# EAGLE board SBC_rev 3 (EAGLE 8.5.0)
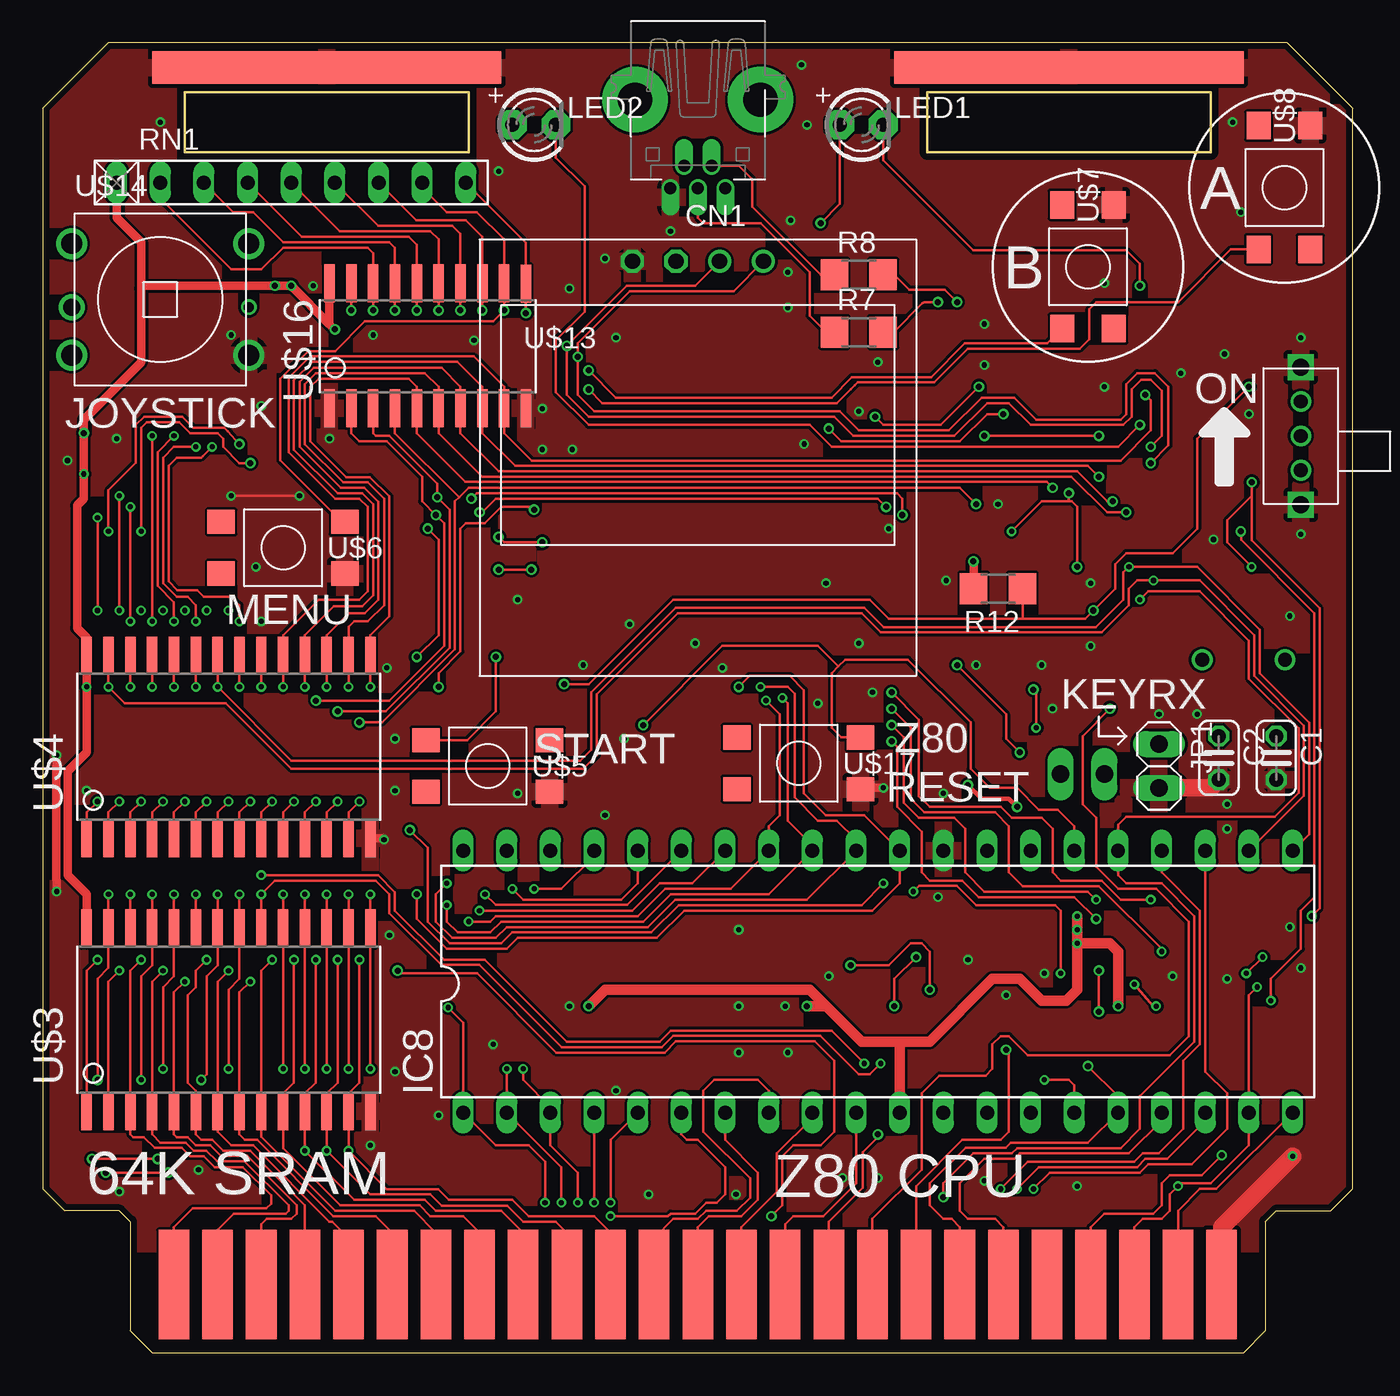
[diagram p2: board, top side]
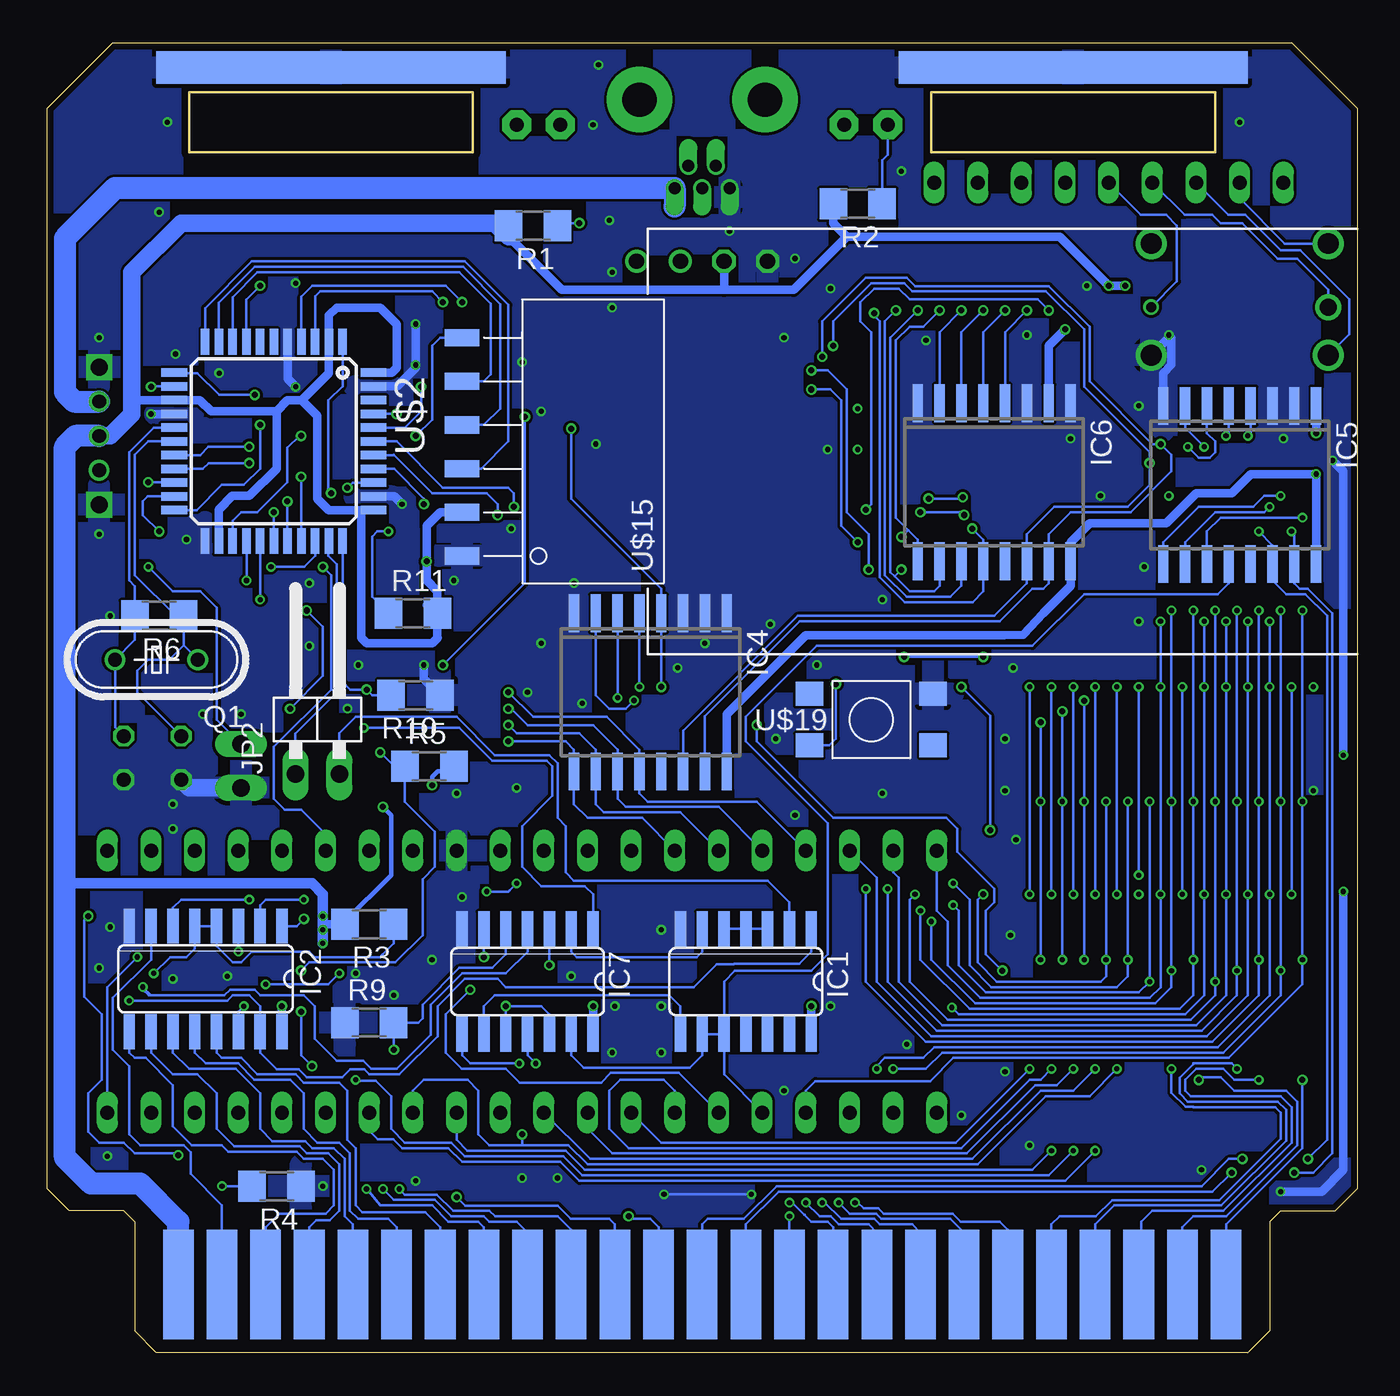
[diagram p3: board, bottom side, seen from below]

Size 76.2 x 76.2 mm. Coordinates in mm from the lower left corner, seen from the top.
Outline: 6.35,0 69.85,0 71.12,1.27 71.12,7.62 71.75,8.26 74.93,8.26 76.2,9.53 76.2,72.39 72.39,76.2 3.81,76.2 0,72.39 0,9.53 1.27,8.26 4.45,8.26 5.08,7.62 5.08,1.27 6.35,0
Outline: 8.26,69.85 24.77,69.85 24.77,73.34 8.26,73.34 8.26,69.85
Outline: 51.44,69.85 67.94,69.85 67.94,73.34 51.44,73.34 51.44,69.85
Copper layers (1*16): Top 0.035559375mm / dielectric 1.6mm / Bottom 0.035559375mm
Design rules "oshpark-2layer": minimum track width 6mil, minimum drill 10mil, track to track 6mil, track to pad 6mil, pad to pad 6mil, via to via 6mil, smd to smd 6mil, copper to edge 15mil, drill to drill 6mil, minimum pad ring 5mil, minimum via ring 5mil, stop-mask expansion 2.5mil, vias tented up to drill 0mil, thermal gap 10mil

## Footprints (pad centres in the part's own frame; a part is rotated, then mirrored left to right if it is on the bottom)
RESISTOR_C025-024X044 = drill 0.813 octagon: 1 -1.27,0; 2 1.27,0
USB-MINIB-THM-MOLEX = drill 0.7 offset: D+ 0,9.72; D- -0.8,8.42; GND 1.6,9.72; ID 0.8,8.42; VBUS -1.6,9.72 | drill 2 pad 3.81: GND1 -3.65,4.57; GND4 3.65,4.57
SO14 = smd 0.66 x 2.032: 1 -3.81,-3.073; 2 -2.54,-3.073; 3 -1.27,-3.073; 4 0,-3.073; 5 1.27,-3.073; 6 2.54,-3.073; 7 3.81,-3.073; 8 3.81,3.073; 9 2.54,3.073; 10 1.27,3.073; 11 0,3.073; 12 -1.27,3.073; 13 -2.54,3.073; 14 -3.81,3.073
SO16 = smd 0.66 x 2.032: 1 -4.445,-3.073; 2 -3.175,-3.073; 3 -1.905,-3.073; 4 -0.635,-3.073; 5 0.635,-3.073; 6 1.905,-3.073; 7 3.175,-3.073; 8 4.445,-3.073; 9 4.445,3.073; 10 3.175,3.073; 11 1.905,3.073; 12 0.635,3.073; 13 -0.635,3.073; 14 -1.905,3.073; 15 -3.175,3.073; 16 -4.445,3.073
SO16W = smd 0.6 x 2.2: 1 -4.445,-4.6; 2 -3.175,-4.6; 3 -1.905,-4.6; 4 -0.635,-4.6; 5 0.635,-4.6; 6 1.905,-4.6; 7 3.175,-4.6; 8 4.445,-4.6; 9 4.445,4.6; 10 3.175,4.6; 11 1.905,4.6; 12 0.635,4.6; 13 -0.635,4.6; 14 -1.905,4.6; 15 -3.175,4.6; 16 -4.445,4.6
DIL40 = drill 0.813 long: 1 -24.13,-7.62; 2 -21.59,-7.62; 3 -19.05,-7.62; 4 -16.51,-7.62; 5 -13.97,-7.62; 6 -11.43,-7.62; 7 -8.89,-7.62; 8 -6.35,-7.62; 9 -3.81,-7.62; 10 -1.27,-7.62; 11 1.27,-7.62; 12 3.81,-7.62; 13 6.35,-7.62; 14 8.89,-7.62; 15 11.43,-7.62; 16 13.97,-7.62; 17 16.51,-7.62; 18 19.05,-7.62; 19 21.59,-7.62; 20 24.13,-7.62; 21 24.13,7.62; 22 21.59,7.62; 23 19.05,7.62; 24 16.51,7.62; 25 13.97,7.62; 26 11.43,7.62; 27 8.89,7.62; 28 6.35,7.62; 29 3.81,7.62; 30 1.27,7.62; 31 -1.27,7.62; 32 -3.81,7.62; 33 -6.35,7.62; 34 -8.89,7.62; 35 -11.43,7.62; 36 -13.97,7.62; 37 -16.51,7.62; 38 -19.05,7.62; 39 -21.59,7.62; 40 -24.13,7.62
1X02 = drill 1.016 long: 1 -1.27,0; 2 1.27,0
1X02/90 = drill 1.016 long: 1 -1.27,-3.81; 2 1.27,-3.81
LED3MM = drill 0.813 pad 1.676 octagon: A -1.27,0; K 1.27,0
HC49/S = drill 0.813: 1 -2.413,0; 2 2.413,0
R1206 = smd 1.6 x 1.803: 1 -1.422,0; 2 1.422,0
RN-9 = drill 0.813 long: 1 -10.16,0; 2 -7.62,0; 3 -5.08,0; 4 -2.54,0; 5 0,0; 6 2.54,0; 7 5.08,0; 8 7.62,0; 9 10.16,0
CARD50 = smd 1.778 x 6.35: P$1 -30.48,-3.81; P$3 -27.94,-3.81; P$5 -25.4,-3.81; P$7 -22.86,-3.81; P$9 -20.32,-3.81; P$11 -17.78,-3.81; P$13 -15.24,-3.81; P$15 -12.7,-3.81; P$17 -10.16,-3.81; P$19 -7.62,-3.81; P$21 -5.08,-3.81; P$23 -2.54,-3.81; P$25 0,-3.81; P$27 2.54,-3.81; P$29 5.08,-3.81; P$31 7.62,-3.81; P$33 10.16,-3.81; P$35 12.7,-3.81; P$37 15.24,-3.81; P$39 17.78,-3.81; P$41 20.32,-3.81; P$43 22.86,-3.81; P$45 25.4,-3.81; P$47 27.94,-3.81; P$49 30.48,-3.81 | smd 1.778 x 6.35 bottom: P$2 -30.48,-3.81; P$4 -27.94,-3.81; P$6 -25.4,-3.81; P$8 -22.86,-3.81; P$10 -20.32,-3.81; P$12 -17.78,-3.81; P$14 -15.24,-3.81; P$16 -12.7,-3.81; P$18 -10.16,-3.81; P$20 -7.62,-3.81; P$22 -5.08,-3.81; P$24 -2.54,-3.81; P$26 0,-3.81; P$28 2.54,-3.81; P$30 5.08,-3.81; P$32 7.62,-3.81; P$34 10.16,-3.81; P$36 12.7,-3.81; P$38 15.24,-3.81; P$40 17.78,-3.81; P$42 20.32,-3.81; P$44 22.86,-3.81; P$46 25.4,-3.81; P$48 27.94,-3.81; P$50 30.48,-3.81
TQFP44 = smd 1.5 x 0.5: 1 -5.8,4; 2 -5.8,3.2; 3 -5.8,2.4; 4 -5.8,1.6; 5 -5.8,0.8; 6 -5.8,0; 7 -5.8,-0.8; 8 -5.8,-1.6; 9 -5.8,-2.4; 10 -5.8,-3.2; 11 -5.8,-4; 23 5.8,-4; 24 5.8,-3.2; 25 5.8,-2.4; 26 5.8,-1.6; 27 5.8,-0.8; 28 5.8,0; 29 5.8,0.8; 30 5.8,1.6; 31 5.8,2.4; 32 5.8,3.2; 33 5.8,4 | smd 0.5 x 1.5: 12 -4,-5.8; 13 -3.2,-5.8; 14 -2.4,-5.8; 15 -1.6,-5.8; 16 -0.8,-5.8; 17 0,-5.8; 18 0.8,-5.8; 19 1.6,-5.8; 20 2.4,-5.8; 21 3.2,-5.8; 22 4,-5.8; 34 4,5.8; 35 3.2,5.8; 36 2.4,5.8; 37 1.6,5.8; 38 0.8,5.8; 39 0,5.8; 40 -0.8,5.8; 41 -1.6,5.8; 42 -2.4,5.8; 43 -3.2,5.8; 44 -4,5.8
SO28-3 = smd 0.61 x 2.21: 1 -8.255,-5.315; 2 -6.985,-5.315; 3 -5.715,-5.315; 4 -4.445,-5.315; 5 -3.175,-5.315; 6 -1.905,-5.315; 7 -0.635,-5.315; 8 0.635,-5.315; 9 1.905,-5.315; 10 3.175,-5.315; 11 4.445,-5.315; 12 5.715,-5.315; 13 6.985,-5.315; 14 8.255,-5.315; 15 8.255,5.315; 16 6.985,5.315; 17 5.715,5.315; 18 4.445,5.315; 19 3.175,5.315; 20 1.905,5.315; 21 0.635,5.315; 22 -0.635,5.315; 23 -1.905,5.315; 24 -3.175,5.315; 25 -4.445,5.315; 26 -5.715,5.315; 27 -6.985,5.315; 28 -8.255,5.315
6MM_TACT = smd 1.6 x 1.4: P$1 -3.6,1.5; P$2 3.6,1.5; P$3 -3.6,-1.5; P$4 3.6,-1.5
GND_PADS = smd 20.32 x 1.905: P$1 0,0
OLED_128X64_I2C = drill 0.9 octagon: P$1 -3.81,-1.27; P$2 -1.27,-1.27 | drill 0.9: P$3 1.27,-1.27; P$4 3.81,-1.27
SKQUCAA010 = drill 1.2: COM 5.15,-3.25; DOWN -5.15,-3.25; P$4 5.15,3.25; UP -5.15,3.25 | drill 1: LEFT -5.15,-0.45 | drill 0.6: RIGHT 5.15,-0.45
SD_RIGHTANGLE = smd 1 x 2: P$1 -6.35,0; P$2 -3.81,0; P$3 -1.27,0; P$4 1.27,0; P$5 3.81,0; P$6 6.35,0
SO20L = smd 0.61 x 2.21: 1 -5.715,-3.635; 2 -4.445,-3.635; 3 -3.175,-3.635; 4 -1.905,-3.635; 5 -0.635,-3.635; 6 0.635,-3.635; 7 1.905,-3.635; 8 3.175,-3.635; 9 4.445,-3.635; 10 5.715,-3.635; 11 5.715,3.61; 12 4.445,3.635; 13 3.175,3.635; 14 1.905,3.635; 15 0.635,3.635; 16 -0.635,3.635; 17 -1.905,3.635; 18 -3.175,3.635; 19 -4.445,3.635; 20 -5.715,3.635
SWITCH = drill 1 square: P$1 -4,0; P$5 4,0 | drill 0.8: P$2 -2,0; P$3 0,0; P$4 2,0

## Placement (x,y rotation side)
C1  22pf  [RESISTOR_C025-024X044]  71.75,34.61 270 top
C2  22pf  [RESISTOR_C025-024X044]  68.42,34.61 270 top
CN1  [USB-MINIB-THM-MOLEX]  38.1,77.47 180 top
IC1  74ALS00D  [SO14]  35.56,21.59 180 bottom
IC2  74LS138D  [SO16]  66.99,21.75 180 bottom
IC4  PCA9534D  [SO16W]  41.12,38.42 180 bottom
IC5  PCA9534D  [SO16W]  6.83,50.48 180 bottom
IC6  PCA9534D  [SO16W]  21.11,50.64 180 bottom
IC7  74LS32D  [SO14]  48.26,21.59 180 bottom
IC8  [DIL40]  48.58,21.59 0 top
JP1  KEYRX  [1X02]  64.93,34.13 270 top
JP2  EXTCLK  [1X02/90]  60.48,37.47 0 bottom
LED1  [LED3MM]  47.62,71.44 0 top
LED2  [LED3MM]  28.57,71.44 0 top
Q1  [HC49/S]  69.85,40.32 180 bottom
R1  1k  [R1206]  47.94,65.56 180 bottom
R2  1k  [R1206]  29.05,66.83 180 bottom
R3  10k  [R1206]  57.47,24.92 180 bottom
R4  10k  [R1206]  62.87,9.68 180 bottom
R5  10k  [R1206]  53.98,34.13 0 bottom
R6  1M  [R1206]  69.69,42.86 180 bottom
R7  22  [R1206]  47.47,59.37 0 top
R8  22  [R1206]  47.47,62.71 0 top
R9  10k  [R1206]  57.47,19.21 0 bottom
R10  10k  [R1206]  54.77,38.26 180 bottom
R11  10k  [R1206]  54.93,43.02 0 bottom
R12  10k  [R1206]  55.56,44.45 180 top
RN1  [RN-9]  14.45,68.07 0 top
U$1  CARDSLOT50  [CARD50]  38.1,7.78 0 top
U$2  ATMEGA32U4-AU  [TQFP44]  63.02,53.02 270 bottom
U$3  IS65C256AL_32KRAM  [SO28-3]  10.79,19.37 0 top
U$4  IS65C256AL_32KRAM  [SO28-3]  10.79,35.24 0 top
U$5  TACT  [6MM_TACT]  25.88,34.13 0 top
U$6  TACT  [6MM_TACT]  13.97,46.83 0 top
U$7  TACT  [6MM_TACT]  60.8,63.18 90 top
U$8  TACT  [6MM_TACT]  72.23,67.79 90 top
U$9  GND_STRIP  [GND_PADS]  16.51,74.77 0 top
U$10  GND_STRIP  [GND_PADS]  59.69,74.77 0 top
U$11  GND_STRIP  [GND_PADS]  16.51,74.77 0 bottom
U$12  GND_STRIP  [GND_PADS]  59.69,74.77 0 bottom
U$13  OLED_SSD1306_I2C  [OLED_128X64_I2C]  38.1,64.77 0 top
U$14  SKQUCAA010  [SKQUCAA010]  6.83,61.28 0 top
U$15  SD_ADAPTER  [SD_RIGHTANGLE]  52.07,52.7 90 bottom
U$16  SN74LS245  [SO20L]  22.38,58.58 0 top
U$17  TACT  [6MM_TACT]  43.97,34.29 0 top
U$18  SWITCH_1825232-1  [SWITCH]  73.18,53.34 90 top
U$19  TACT  [6MM_TACT]  28.26,36.83 180 bottom

## Tracks (layer width: path | path; a pad name or v marks a point on that pad's centre or on a via)
$A0
  Bottom 0.152: IC2.13 66.36,17.46 66.04,17.14 64.93,17.14 63.98,16.19 61.75,16.19 61.28,15.72 59.21,15.72 58.74,15.24 58.74,12.38 58.26,11.91 58.26,8.57 57.86,8.18 54.21,8.18 53.34,7.3 U$1.P$38
$B0
  Bottom 0.152: IC2.12 67.63,17.46 66.99,16.83 65.1,16.83 64.15,15.88 62.07,15.88 61.28,15.08 61.28,13.02 60.48,12.22 59.21,12.22 58.59,11.6 58.59,8.26 58.12,7.78 56.36,7.78 55.88,7.3 U$1.P$40
$C0
  Bottom 0.152: IC2.11 68.9,17.46 67.94,16.51 65.25,16.51 63.82,15.08 63.82,13.02 63.1,12.3 61.2,12.3 60.8,11.91 59.53,11.91 58.9,11.27 58.9,7.94 58.42,7.46 U$1.P$42
$D0
  Bottom 0.152: IC2.10 70.17,17.46 68.9,16.19 67.47,16.19 66.36,15.08 66.36,13.02 65.34,12 61.53,12 61.12,11.59 59.85,11.59 59.23,10.97 59.23,8.24 59.77,7.7 60.56,7.7 60.96,7.3 U$1.P$44
$E0
  Bottom 0.152: IC2.9 71.44,17.46 71.12,17.14 70.48,17.14 68.9,15.56 68.9,13.18 67.79,12.06 66.04,12.06 65.67,11.69 61.7,11.69 61.28,11.27 60.17,11.27 59.53,10.64 59.53,8.57 60.01,8.1 62.71,8.1 63.5,7.3 U$1.P$46
$F0
  Bottom 0.152: IC2.7 70.17,22.86 72.39,20.64 72.39,17.62 71.44,16.67 71.44,12.7 70.8,12.06 68.26,12.06 67.87,11.67 67.87,10.4 66.04,8.57 U$1.P$48
/ATMELSERIAL  (via drill 0.3, 0.35)
  Top 0.152: v69.69,47.78 69.71,47.73 69.71,47.29 73.98,43.02 73.98,26.51 73.18,25.72 73.18,23.5 71.44,21.75 v71.44,20.48
  Bottom 0.152: IC1.1 31.75,23.34 32.46,22.62 36.23,22.62 36.25,22.6 37.25,22.6 38.58,21.27 49.53,21.27 50.01,21.75 51.91,21.75 53.5,20.16 53.5,18.41 55.72,16.19 57.47,16.19 57.77,16.5 58.58,16.5 59.04,16.03 61.12,16.03 61.58,16.5 62.85,16.5 63.82,17.46 IC2.15 63.82,20.16 64.45,20.8 65.41,20.8 65.72,20.48 v71.44,20.48 | v69.69,47.78 70.64,48.74 70.64,49.53 70.35,49.82 U$2.21
/BUSREQ  (via drill 0.3, 0.35)
  Top 0.152: v63.82,43.81 64.29,44.29 67.31,44.29 70.17,41.43 70.17,39.21 73.06,36.32 73.06,32.58 71.68,31.19 63.02,31.19 62.55,30.72 IC8.25 62.55,27.78 63.02,27.3 65.09,27.3 66.99,25.4 66.99,18.1 63.82,14.92 63.82,13.02 62.71,11.91 56.67,11.91 56.36,11.59 54.13,11.59 52.39,9.84 v52.39,9.05
  Bottom 0.152: v63.82,43.81 63.82,44.93 U$2.27 | U$1.P$30 43.18,7.46 43.5,7.78 45.73,7.78 46.51,8.56 51.9,8.56 v52.39,9.05
/BUTTONS  (via drill 0.3, 0.35)
  Top 0.152: U$16.19 v17.94,60.64 | v21.35,30.4 22.38,29.37 22.38,25.08 23.65,23.81 26.67,23.81 27.3,24.45 35.4,24.45 36.99,26.04 47.62,26.04 v48.9,27.3 | v28.57,49.05 28.42,49.21 26.67,49.21 25.72,48.26 24.61,48.26 24.29,47.94 24.29,40.8 23.02,39.53 v23.02,38.73 | v59.21,22.07 59.21,25.72 58.9,26.04 54.29,26.04 53.17,27.16 50.97,27.16 v50.64,26.83 | v63.5,21.43 64.61,20.16 v64.77,20.16
  Bottom 0.152: v17.94,60.64 18.57,61.28 26.04,61.28 26.67,61.91 28.1,61.91 28.89,61.12 28.89,60.01 28.26,59.37 28.26,49.37 v28.57,49.05 | v59.21,22.07 59.85,21.43 v63.5,21.43 | 49.29,26.91 v48.9,27.3 49.37,26.83 v50.64,26.83 | v64.77,20.16 65.09,19.84 IC2.14 | v21.35,30.4 21.35,37.07 v23.02,38.73
/HIGH32KRAM  (via drill 0.3)
  Top 0.152: U$3.20 v12.7,26.67 13.49,27.46 19.37,27.46 20.16,26.67 20.16,25.56 23.16,22.55 25.39,22.55 30.18,17.77 36.01,17.77 36.67,18.43 45.23,18.43 47.47,16.19 48.1,16.19 v48.74,16.83
  Bottom 0.152: IC7.8 52.07,17.3 51.59,16.83 v48.74,16.83
/IOREQ  (via drill 0.3)
  Top 0.152: U$1.P$47 66.04,8.26 67.31,9.53 68.26,9.53 IC8.20 | v70.01,22.07 v70.96,23.02
  Bottom 0.152: v70.96,23.02 72.71,21.27 IC8.20 | R3.1 56.05,23.81 56.67,23.18 56.83,23.02 60.64,23.02 60.96,23.34 64.29,23.34 64.93,22.7 65.41,22.7 66.36,23.65 IC2.4 IC2.5 67.63,23.5 68.1,23.02 69.06,23.02 v70.01,22.07
/LOW32KRAM  (via drill 0.3)
  Top 0.152: v12.7,27.78 19.37,27.78 19.38,27.77 19.49,27.77 20.48,26.78 20.48,25.72 23.34,22.86 25.56,22.86 25.72,22.85 30.47,18.1 35.88,18.1 36.51,18.73 45.88,18.73 v47.78,16.83 | v12.7,38.73 U$4.20
  Bottom 0.152: IC7.11 48.26,17.3 v47.78,16.83 | v12.7,27.78 v12.7,38.73
/LOW64K  (via drill 0.35)
  Top 0.152: U$1.P$35 50.8,9.68 53.5,12.38 55.72,12.38 56.2,12.86 56.2,17.46 v56.04,17.62
  Bottom 0.152: IC7.5 49.53,23.18 50.32,22.38 52.23,22.38 54.37,20.24 54.37,19.45 54.61,19.21 R9.2 v56.05,17.63 v56.04,17.62
/MREQ  (via drill 0.3)
  Top 0.152: U$1.P$45 63.5,7.3 63.98,7.78 65.09,7.78 65.56,8.26 65.56,9.21 v66.04,9.68 66.2,9.84 67.94,9.84 70.17,12.06 IC8.19 70.17,20.8 v70.64,21.27
  Bottom 0.152: IC7.4 48.26,23.34 49.53,22.07 52.07,22.07 53.9,20.24 53.9,18.49 55.88,16.51 57.35,16.51 57.83,16.99 59.37,16.99 60.64,18.26 60.64,20.16 61.28,20.8 63.82,20.8 64.14,21.11 65.56,21.11 65.89,20.78 70.17,20.78 | R4.2 v66.04,9.68 | 70.17,20.78 70.31,20.78 70.64,21.11 v70.64,21.27 70.17,20.8 70.17,20.78
/SDCS  (via drill 0.35)
  Top 0.152: v54.77,53.34 v61.44,53.34
  Bottom 0.152: U$2.25 65.42,48.4 64.93,48.9 63.98,48.9 62.23,50.64 62.23,52.64 61.53,53.34 v61.44,53.34 | v54.77,53.34 53.82,54.29 53.82,58.58 53.34,59.05 U$15.P$6
A  (via drill 0.35)
  Top 0.152: RN1.6 19.49,65.56 23.81,65.56 24.29,65.09 U$16.14 v24.29,60.64 | U$8.P$1 69.11,64.19 66.04,61.12 61.28,61.12 60.88,60.72 60.88,58.98 60.32,58.41 53.81,58.41 51.84,56.45 47.4,56.45 47.23,56.28 46.99,56.04 46.2,55.24 32.54,55.24 v31.75,56.04 | v29.05,47.15 26.83,47.15 v26.51,47.47 26.35,47.62
  Bottom 0.152: IC6.9 25.56,47.31 26.11,47.86 | v24.29,60.64 25.24,59.69 26.04,59.69 26.83,58.9 26.83,48.58 26.11,47.86 | v31.75,56.04 30.64,56.04 30,55.4 30,48.1 v29.05,47.15 | 26.11,47.86 v26.51,47.47
A0  (via drill 0.3, 0.35)
  Top 0.152: v14.61,32.07 13.97,31.43 U$4.10 | U$1.P$15 25.4,6.99 24.45,7.94 22.54,7.94 21.91,8.57 17.3,8.57 13.97,11.91 U$3.10 13.97,15.08 14.61,15.72 v14.61,22.86 | v21.75,26.67 21.75,25.24 23.5,23.5 26.99,23.5 27.62,24.13 35.72,24.13 37.31,25.72 48.26,25.72 49.85,27.3 IC8.30 47.78,31.27 45.54,31.27 44.27,32.54 44.27,38.55 43.45,39.37 41.12,39.37 v40.48,38.73 | v55.88,54.61 54.93,54.61 53.34,53.02 46.46,53.02 v45.72,53.76
  Bottom 0.152: v14.61,32.07 v14.61,22.86 14.61,21.91 14.92,21.59 20.95,21.59 22.07,22.7 22.07,26.35 v21.75,26.67 | v40.48,38.73 IC4.4 40.48,44.45 45.72,49.69 v45.72,53.76 | U$2.41 55.89,54.62 v55.88,54.61
A1  (via drill 0.3)
  Top 0.152: v13.34,22.86 12.7,22.23 U$3.9 12.7,12.57 17.02,8.26 21.59,8.26 22.86,6.99 U$1.P$13 | v13.34,32.07 12.7,31.43 U$4.9 | v23.5,27.3 22.86,26.67 22.86,25.08 23.81,24.13 26.35,24.13 26.99,24.77 35.2,24.77 36.78,26.35 44.45,26.35 IC8.31 47.31,29.84 46.2,30.96 45.09,30.96 43.74,32.31 43.74,38.34 43.34,38.73 v41.75,38.73
  Bottom 0.152: v13.34,32.07 v13.34,22.86 13.34,21.91 13.97,21.27 21.27,21.27 22.54,22.54 22.54,26.35 v23.5,27.3 | IC4.5 v41.75,38.73
A2  (via drill 0.3)
  Top 0.152: v12.06,21.59 11.43,20.95 U$3.8 11.43,12.7 11.75,12.38 12.46,12.38 16.89,7.95 16.93,7.95 16.94,7.94 19.37,7.94 20.32,6.99 U$1.P$11 | U$4.8 11.43,31.43 v12.06,32.07 | v23.5,26.04 23.5,25.08 24.13,24.45 26.04,24.45 26.67,25.08 34.92,25.08 36.51,26.67 42.23,26.67 IC8.32 44.77,29.53 43.34,30.96 43.34,37.78 v43.02,38.1
  Bottom 0.152: v12.06,32.07 v12.06,21.59 12.7,20.95 21.59,20.95 23.18,22.54 23.18,25.72 v23.5,26.04 | IC4.6 v43.02,38.1
A3  (via drill 0.3)
  Top 0.152: v10.79,22.23 10.16,21.59 U$3.7 10.16,12.86 10.95,12.06 12.22,12.06 16.67,7.62 16.83,7.62 17.78,6.67 U$1.P$9 17.78,6.99 | v10.79,32.07 10.16,31.43 U$4.7 | v24.77,25.08 26.04,25.08 26.35,25.4 34.61,25.4 36.2,26.99 40.01,26.99 IC8.33 42.23,30.64 42.86,31.27 42.86,37.15 v42.07,37.94
  Bottom 0.152: v10.79,43.18 v10.79,32.07 v10.79,22.23 10.79,21.27 11.75,20.32 22.23,20.32 24.77,22.86 v24.77,25.08 | IC4.7 44.29,38.26 43.5,37.47 42.55,37.47 v42.07,37.94
A4  (via drill 0.3, 0.35)
  Top 0.152: v9.53,22.86 8.89,22.23 8.89,21.27 8.41,20.8 8.41,15.72 8.89,15.24 U$3.6 8.89,12.7 9.21,12.38 9.84,12.38 10.48,11.75 12.06,11.75 15.24,8.57 U$1.P$7 | v9.53,32.07 8.89,31.43 U$4.6 | IC8.34 37.78,27.3 35.88,27.3 34.29,25.72 v25.4,25.72 | v49.37,35.56 49.69,35.24 49.69,31.75 51.12,30.32 51.12,27.94 51.59,27.46 53.5,27.46 54.45,26.51 60.01,26.51 v61.28,25.24
  Bottom 0.152: v25.4,25.72 25.4,22.86 22.54,20 10.32,20 9.53,20.8 v9.53,22.86 v9.53,32.07 v9.53,43.18 | IC8.34 41.59,31.11 44.77,31.11 45.56,31.91 IC4.9 45.56,35.08 46.04,35.56 v49.37,35.56 | IC2.1 61.7,24.82 v61.28,25.24
A5  (via drill 0.3, 0.35)
  Top 0.152: v8.26,21.59 7.62,20.95 U$3.5 7.62,12.7 7.78,12.54 8.41,12.54 8.89,12.06 9.73,12.06 10.35,11.44 11.89,11.44 14.76,8.57 14.76,8.1 14.45,7.78 13.02,7.78 12.7,7.46 U$1.P$5 | v8.26,32.07 7.62,31.43 U$4.5 | v25.72,26.67 26.34,26.05 33.98,26.05 IC8.35 | v61.28,26.35 60.8,26.83 54.77,26.83 53.66,27.94 53.66,30.48 53.02,31.11 50.96,31.11 50.09,31.99 50.09,35.8 v49.37,36.51
  Bottom 0.152: v25.72,26.67 26.04,26.35 26.04,21.59 23.81,19.37 9.68,19.37 8.26,20.8 v8.26,21.59 v8.26,32.07 v8.26,43.18 | IC8.35 39.37,31.43 43.81,31.43 44.29,31.91 IC4.10 44.29,35.08 45.24,36.04 48.9,36.04 v49.37,36.51 | v61.28,26.35 63.5,26.35 63.82,26.04 IC2.2
A6  (via drill 0.3, 0.35)
  Top 0.152: v6.99,22.23 6.35,21.59 U$3.4 6.35,12.7 6.83,12.22 8.3,12.22 8.76,11.76 9.51,11.76 10.13,11.14 11.72,11.14 14.29,8.57 14.29,8.26 14.13,8.1 11.11,8.1 10.16,7.14 U$1.P$3 | v6.99,32.07 6.35,31.43 U$4.4 | v27.3,26.99 27.94,26.35 33.66,26.35 34.61,27.3 IC8.36 | v49.37,37.47 50.48,36.35 50.48,32.23 51.28,31.43 55.4,31.43 56.2,30.64 56.2,27.94 56.99,27.15 61.44,27.15 65.09,23.5 v65.09,23.34
  Bottom 0.152: v27.3,26.99 27.3,21.59 24.45,18.73 9.05,18.73 6.99,20.8 v6.99,22.23 v6.99,32.07 v6.99,43.18 | IC8.36 37.15,31.75 42.55,31.75 43.02,32.23 IC4.11 43.02,35.08 44.45,36.51 48.26,36.51 49.21,37.47 v49.37,37.47 | IC2.3 v65.09,23.34
A7  (via drill 0.3, 0.35)
  Top 0.152: v5.71,22.86 5.08,22.23 U$3.3 5.08,12.7 5.24,12.54 5.87,12.54 6.5,11.92 8.08,11.92 8.57,11.43 9.37,11.43 10,10.79 11.63,10.79 13.28,9.15 13.28,8.67 13.01,8.4 8.72,8.4 7.62,7.3 U$1.P$1 | v5.71,32.07 5.08,31.43 U$4.3 | IC8.37 32.07,28.89 30.16,26.99 v28.57,26.99 | v49.37,38.42 50.96,36.83 50.96,32.38 51.59,31.75 55.72,31.75 56.36,31.11 58.1,31.11 58.74,30.48 58.74,27.94 59.21,27.46 61.59,27.46 62.71,26.35 v64.45,26.35
  Bottom 0.152: v28.57,26.99 28.57,21.59 25.08,18.1 8.41,18.1 5.71,20.8 v5.71,22.86 v5.71,32.07 v5.71,43.18 | IC8.37 34.92,32.07 41.27,32.07 41.75,32.54 IC4.12 41.75,35.08 43.66,36.99 47.94,36.99 v49.37,38.42 | IC2.6 68.9,25.88 68.42,26.35 v64.45,26.35
A8  (via drill 0.3)
  Top 0.152: v6.35,26.67 U$3.25 6.35,22.54 5.71,21.91 v5.71,15.88 | v6.35,38.73 U$4.25 | v6.35,42.55 v6.35,53.34
  Bottom 0.152: IC8.38 27.94,27.62 27.94,21.59 24.77,18.41 8.73,18.41 6.35,20.8 v6.35,26.67 v6.35,38.73 v6.35,42.55 | v6.35,53.34 6.19,53.5 IC5.4 | v5.71,15.88 7.14,15.88 7.78,16.51 9.37,16.51 10,15.88 10,15.24 9.68,14.92 4.45,14.92 3.81,14.29 3.81,12.22 7.78,8.26 11.91,8.26 12.54,7.62 12.54,4.13 U$1.P$6
A9  (via drill 0.3)
  Top 0.152: v7.62,26.67 U$3.24 7.62,21.91 6.99,21.27 v6.99,16.51 | v7.62,38.73 U$4.24 | v7.62,42.55 7.62,43.66 6.67,44.61 6.67,52.39 v7.62,53.34
  Bottom 0.152: IC8.39 26.99,27.94 26.67,27.62 26.67,21.59 24.13,19.05 9.37,19.05 7.62,20.8 v7.62,26.67 v7.62,38.73 v7.62,42.55 | v7.62,53.34 7.46,53.5 IC5.5 | v6.99,16.51 7.3,16.83 9.53,16.83 9.53,16.78 10.31,16 10.31,15.09 10.32,15.08 9.84,14.61 4.6,14.61 4.13,14.13 4.13,12.34 7.89,8.57 14.13,8.57 15.24,7.46 U$1.P$8
A10  (via drill 0.3)
  Top 0.152: v11.43,26.67 U$3.21 11.43,21.75 10.79,21.11 v10.79,16.51 | U$4.21 v11.43,38.73 | v11.43,42.55 11.43,43.5 10.95,43.97 9.37,43.97 8.97,44.37 7.81,44.37 7.32,44.87 7.32,51.61 7.78,52.07 9.21,52.07 9.29,52.15 | v9.84,52.7 9.29,52.15 | 9.29,52.15
  Bottom 0.152: IC8.40 24.45,25.72 23.81,25.08 23.81,22.54 21.91,20.64 12.06,20.64 11.43,21.27 v11.43,26.67 v11.43,38.73 v11.43,42.55 | v9.84,52.7 9.21,52.07 8.57,52.07 8.26,52.39 8.26,53.02 8.73,53.5 IC5.6 | U$1.P$10 17.78,7.46 17.3,7.94 15.2,7.94 14.26,8.88 8.02,8.88 4.45,12.45 4.45,13.97 4.76,14.29 9.53,14.29 9.54,14.3 9.97,14.3 10.79,15.13 v10.79,16.51
A11  (via drill 0.3)
  Top 0.152: U$3.23 v8.89,26.67 | v8.89,38.73 U$4.23 | v29.21,8.73 29.21,11.11 28.26,12.06 26.35,12.06 IC8.1 24.45,19.21 v23.57,20.08 | v8.89,42.55 8.89,43.5 8.41,43.97 7.78,43.97 6.99,44.77 6.99,52.07 7.62,52.7 v8.89,52.7
  Bottom 0.152: U$1.P$12 20.32,7.14 20.8,7.62 23.06,7.62 23.53,8.08 27.54,8.08 27.85,8.39 28.71,8.39 29.05,8.73 v29.21,8.73 | v8.89,42.55 v8.89,38.73 v8.89,26.67 8.89,20.8 10,19.68 23.18,19.68 v23.57,20.08 | v8.89,52.7 10,53.82 IC5.7
A12  (via drill 0.3)
  Top 0.152: U$3.2 3.81,21.59 v4.45,22.23 | v4.45,32.07 3.81,31.43 U$4.2 | v26.99,16.51 IC8.2 30.16,10.79 v30.16,8.73 | v4.45,49.85 v4.45,43.18
  Bottom 0.152: U$1.P$14 22.86,6.99 23.65,7.78 27.67,7.78 27.97,8.08 29.52,8.08 v30.16,8.73 | v4.45,43.18 v4.45,32.07 v4.45,22.23 4.45,20.8 7.78,17.46 24.13,17.46 25.08,16.51 v26.99,16.51 | IC5.9 11.27,47.15 9.21,49.21 6.03,49.21 5.4,49.85 v4.45,49.85
A13  (via drill 0.3)
  Top 0.152: U$3.26 v5.08,26.67 | v5.08,38.73 U$4.26 | v27.94,16.51 27.94,15.88 29.53,14.29 IC8.3 29.53,12.06 31.11,10.48 v31.11,8.73 | v5.08,49.21 v5.08,42.55
  Bottom 0.152: U$1.P$16 25.4,6.99 25.88,7.46 27.78,7.46 28.1,7.78 30,7.78 30.96,8.73 v31.11,8.73 | v5.08,42.55 v5.08,38.73 v5.08,26.67 5.08,20.8 8.1,17.78 24.61,17.78 25.24,17.14 27.46,17.14 27.94,16.67 v27.94,16.51 | IC5.10 10,47.15 8.26,48.9 5.4,48.9 v5.08,49.21
A14  (via drill 0.3)
  Top 0.152: U$3.1 2.54,22.23 v3.17,22.86 | U$4.1 2.54,31.43 v3.17,32.07 | IC8.4 v32.07,8.73 | v3.17,48.58 v3.17,43.18
  Bottom 0.152: IC8.4 32.07,15.24 31.51,15.8 24.84,15.8 23.5,17.14 7.46,17.14 3.17,21.43 v3.17,22.86 v3.17,32.07 v3.17,43.18 | U$1.P$18 27.94,6.99 28.42,7.46 30.16,7.46 30.63,7.92 31.26,7.92 v32.07,8.73 | IC5.11 8.73,47.78 7.94,48.58 v3.17,48.58
A15  (via drill 0.3)
  Top 0.152: IC8.5 33.02,12.38 v33.02,8.73
  Bottom 0.152: U$1.P$20 30.48,4.92 30.48,6.67 30.48,7.3 30.8,7.62 31.75,7.62 32.15,8.03 | 32.15,8.03 32.13,8.01 | IC1.10 IC1.9 38.1,17.3 38.83,16.58 44.99,16.58 45.72,17.3 IC7.13 | IC1.10 36.83,16.19 IC8.5 | IC5.12 7.46,44.77 8.1,44.13 15.88,44.13 18.89,41.12 31.43,41.12 35.56,36.99 35.56,35.56 30.8,30.8 30.8,23.18 31.75,22.23 36.2,22.23 36.83,21.59 IC1.10 | v33.02,8.73 32.86,8.73 32.15,8.03
B  (via drill 0.35)
  Top 0.152: RN1.7 21.72,65.88 24.61,65.88 25.56,64.93 U$16.13 v25.56,60.64 | U$7.P$1 58.44,58.72 53.64,58.72 51.67,56.75 47.07,56.75 45.88,55.56 33.34,55.56 v31.75,57.15 | v28.42,45.56 v26.51,45.56
  Bottom 0.152: v25.56,60.64 27.15,59.05 27.15,45.4 26.91,45.16 | 26.91,45.16 26.04,44.29 24.61,44.29 24.29,44.61 IC6.10 | v31.75,57.15 30.8,57.15 29.69,56.04 29.69,48.9 28.42,47.62 v28.42,45.56 | v26.51,45.56 26.91,45.16
BUSAK  (via drill 0.3)
  Top 0.152: v57.63,9.53 58.58,10.48 63.82,10.48 64.29,10.95 66.83,10.95 68.9,13.02 68.9,15.08 67.63,16.35 IC8.23
  Bottom 0.152: U$1.P$36 50.8,7.3 51.12,7.62 52.86,7.62 53.82,8.57 56.83,8.57 v57.63,9.53
D0  (via drill 0.3, 0.35)
  Top 0.152: U$4.11 15.24,31.43 v15.88,32.07 | U$1.P$17 27.94,6.99 26.67,8.26 22.86,8.26 22.23,8.89 18.1,8.89 v15.24,11.75 U$3.11 15.24,15.08 15.88,15.72 v15.88,22.86 | U$16.2 17.94,53.5 18.41,53.02 20,53.02 22.07,50.96 22.07,49.53 v22.86,48.74 23.34,48.26 23.34,41.14 20.14,37.94 v15.88,37.94 | v25.4,48.9 25.56,48.9 26.35,49.69 48.58,49.69 v49.05,49.21
  Bottom 0.152: v15.88,22.86 v15.88,32.07 v15.88,37.94 15.88,38.1 | v15.24,11.75 16.99,10 45.24,10 46.35,11.11 52.07,11.11 52.86,11.91 55.56,11.91 56.06,12.4 56.97,12.4 57.47,12.9 IC8.14 | v22.86,48.74 v22.87,48.74 23.03,48.9 v25.4,48.9 | U$2.39 55.88,53.02 53.18,50.32 49.37,50.32 49.05,50.01 v49.05,49.21
D1  (via drill 0.3, 0.35)
  Top 0.152: v17.14,32.07 16.51,31.43 U$4.12 | U$1.P$19 30.48,6.99 29.84,7.62 27.94,7.62 27,8.56 23.19,8.56 22.54,9.21 19.05,9.21 v16.51,11.75 U$3.12 16.51,15.08 17.14,15.72 v17.14,22.86 | v58.26,15.88 59.69,15.88 60.01,15.56 IC8.15 | U$16.3 19.21,53.5 19.37,53.34 20.16,53.34 22.94,50.56 v22.94,49.77 23.65,49.05 23.65,41.03 19.93,37.31 v17.14,37.31 | v24.92,49.69 25.24,50.01 49.69,50.01 50.01,49.69 v50.01,48.74
  Bottom 0.152: v17.14,22.86 v17.14,32.07 v17.14,37.31 | v16.51,11.75 17.94,10.32 45.09,10.32 46.2,11.43 51.91,11.43 52.7,12.22 55.4,12.22 56.2,13.02 56.2,14.92 57.09,15.81 58.13,15.81 v58.26,15.88 | v22.94,49.77 23.02,49.69 v24.92,49.69 | U$2.38 56.05,52.22 56.04,52.23 53.82,50.01 50.64,50.01 50.01,49.37 v50.01,48.74
D2  (via drill 0.3, 0.35)
  Top 0.152: v18.41,32.07 17.78,31.43 U$4.13 | U$1.P$21 33.02,6.99 32.07,7.94 28.26,7.94 27.3,8.89 23.61,8.89 22.99,9.51 20.02,9.51 v17.78,11.75 U$3.13 17.78,15.08 18.41,15.72 v18.41,22.86 | U$16.4 20.48,53.5 24.21,49.77 | v54.29,49.37 53.34,50.32 24.77,50.32 24.21,49.77 | 24.21,49.77 23.97,49.53 23.97,40.91 19.73,36.67 v18.41,36.67
  Bottom 0.152: v18.41,22.86 v18.41,32.07 v18.41,36.67 | v17.78,11.75 18.89,10.64 44.93,10.64 46.05,11.76 51.77,11.76 52.39,12.38 IC8.12 | U$2.37 56.03,51.42 54.29,49.69 v54.29,49.37
D3  (via drill 0.3, 0.35)
  Top 0.152: v19.05,26.67 U$3.15 v19.05,16.51 | v19.05,38.73 U$4.15 19.05,41.75 20.15,42.85 20.15,49.81 19.02,50.95 17.63,50.95 15.56,53.02 15.56,56.2 16.03,56.67 21.27,56.67 21.75,56.2 U$16.5 21.75,53.5 24.58,50.67 58.4,50.67 v58.74,50.32 | 35.56,6.99 U$1.P$23 35.56,6.67 36.67,7.78 38.1,7.78 38.58,8.26 40.37,8.26 41.14,9.03 41.14,10.14 38.42,12.86 38.42,15.24 39.05,15.88 41.59,15.88 42.23,15.24 IC8.8
  Bottom 0.152: v19.05,26.67 v19.05,38.73 | v19.05,16.51 23.34,12.22 40.48,12.22 IC8.8 | v58.74,50.32 58.44,50.62 U$2.36
D4  (via drill 0.3, 0.35)
  Top 0.152: v17.78,26.67 U$3.16 v17.78,16.51 | v17.78,38.73 U$4.16 17.78,42.23 18.1,42.55 18.89,42.55 19.84,43.5 19.84,49.69 18.89,50.64 17.46,50.64 15.24,52.86 15.24,56.36 15.88,56.99 22.23,56.99 23.02,56.2 U$16.6 23.02,53.5 25.55,50.97 59.84,50.97 61.91,48.9 v63.02,48.9 | 38.1,6.67 U$1.P$25 38.1,7.3 38.73,7.94 40.64,7.94 41.59,8.89 41.59,10.48 39.69,12.38 IC8.7
  Bottom 0.152: v17.78,26.67 v17.78,38.73 | IC8.7 39.69,15.24 40.32,15.88 42.86,15.88 43.5,15.24 43.5,13.02 42.39,11.91 23.02,11.91 19.05,15.88 18.41,15.88 v17.78,16.51 | U$2.28 v63.02,48.9
D5  (via drill 0.3, 0.35)
  Top 0.152: v16.51,26.67 U$3.17 v16.51,16.51 | v16.51,38.73 U$4.17 16.51,41.75 17.78,43.02 18.73,43.02 19.51,43.8 19.51,49.5 18.7,50.31 17.33,50.31 14.94,52.7 14.94,56.48 15.75,57.3 23.19,57.3 24.29,56.2 U$16.7 24.29,53.5 26.51,51.28 60.17,51.28 61.91,49.53 v62.23,49.53 | U$1.P$27 40.64,7.3 42.7,9.37 42.7,11.59 44.77,13.65 IC8.9
  Bottom 0.152: v16.51,26.67 v16.51,38.73 | IC8.9 44.77,13.02 43.34,11.59 22.7,11.59 18.73,15.56 17.46,15.56 v16.51,16.51 | v62.23,49.53 U$2.29
D6  (via drill 0.3, 0.35)
  Top 0.152: v15.24,26.67 U$3.18 v15.24,16.51 | v15.24,38.73 U$4.18 15.24,41.75 16.93,43.44 18.57,43.44 19.21,44.08 19.21,49.37 18.57,50.01 17.14,50.01 14.61,52.55 14.61,56.58 15.68,57.66 24.1,57.66 25.56,56.2 U$16.8 25.56,53.5 27.46,51.59 60.8,51.59 v61.44,50.96 | 47.31,12.7 IC8.10 47.31,9.84 45.4,7.94 43.66,7.94 43.18,7.46 U$1.P$29
  Bottom 0.152: v15.24,26.67 v15.24,38.73 | v61.44,50.96 61.44,47.23 U$2.30 | IC8.10 44.61,11.27 22.38,11.27 18.41,15.24 16.51,15.24 v15.24,16.51
D7  (via drill 0.3, 0.35)
  Top 0.152: v13.97,26.67 U$3.19 v13.97,16.51 | v13.97,38.73 U$4.19 13.97,41.75 16.03,43.81 18.41,43.81 18.89,44.29 18.89,49.21 18.41,49.69 17,49.69 14.3,52.39 14.3,56.71 15.56,57.97 25.06,57.97 26.83,56.2 U$16.9 26.83,53.5 28.43,51.9 62.69,51.9 64.45,53.66 64.45,55.4 v64.14,55.72 | U$1.P$31 45.72,7.62 47.7,9.6 47.7,11.67 48.58,12.54 v48.58,12.7
  Bottom 0.152: v13.97,26.67 v13.97,38.73 | v13.97,16.51 15.56,14.92 18.1,14.92 22.07,10.95 44.77,10.95 45.88,12.06 48.58,12.06 | IC8.13 54.93,15.24 54.29,15.88 51.75,15.88 51.12,15.24 51.12,12.7 50.48,12.06 48.58,12.06 | U$2.12 68.79,56.99 67.47,56.99 66.2,55.72 v64.14,55.72 | v48.58,12.7 48.58,12.06
D+  (via drill 0.35)
  Top 0.152: v52.07,61.12 51.27,61.12 51.17,61.05 49.5,59.37 R7.2
  Bottom 0.152: U$2.4 61.42,61.45 60.8,62.07 53.33,62.07 53.3,62.08 53.28,62.07 53.02,62.07 v52.07,61.12
D-  (via drill 0.35)
  Top 0.152: R8.2 49.53,62.71 50.4,61.83 52.47,61.83 v53.18,61.12
  Bottom 0.152: U$2.3 60.62,61.45 60.33,61.75 53.82,61.75 v53.18,61.12
DOWN  (via drill 0.35)
  Top 0.152: RN1.3 11.08,66.36 12.22,66.36 13.97,64.61 17.3,64.61 20.16,64.61 20.48,64.29 U$16.17 20.48,62.07 v20.48,60.64
  Bottom 0.152: U$14.DOWN 0.46,59.25 0.46,61.28 3.31,64.14 4.45,64.14 6.51,66.2 7.49,66.2 RN1.3 | IC6.5 21.75,59.37 v20.48,60.64
FASTCLK
  Bottom 0.152: U$2.32 59.85,47.2 59.85,46.35 59.37,45.88 59.37,38.42 61.78,36.01 61.78,33.72 JP2.1
GND  (via drill 0.3)
  Top 0.152: v10.95,49.85 v14.92,49.85
  Top 0.508: v48.9,32.86 47.65,32.86 U$17.P$4 | U$4.14 19.76,29.93 v19.84,29.84 | v0.79,34.77 0.79,34.11 0.77,34.09 0.77,27.51 0.79,27.48 v0.79,26.83 | 68.58,7.3 68.74,7.62 68.58,7.46 68.58,7.3
  Top 1.016: JP1.2 67.94,32.86 C2.2 | v72.71,11.43 68.58,7.3 U$1.P$49
  Bottom 0.152: v35.24,9.21 v40.32,9.21
  Bottom 0.508: v54.77,59.85 54.77,57.31 55.85,56.22 U$2.43 | U$2.5 62.22,56.67 v61.75,56.2 | v70.17,54.61 68.84,54.61 U$2.15 | IC5.8 11.27,56.99 10.79,57.47 10.79,59.05 v10.95,59.21 10.95,59.05 U$14.COM | U$2.35 56.01,49.82 v55.56,49.37 | v54.29,40.01 54.29,39.2 R10.1 | v0.79,26.83 0.79,10.64 2.06,9.37 v4.45,9.37 | v0.79,34.77 0.79,51.28 v1.43,51.91
  Bottom 1.016: C2.2 67.94,32.86 JP1.2
  other vias: 60.17,9.68 45.72,21.91 68.9,30.48 53.82,22.86 40.48,24.61 30.64,20.16 16.67,53.18 29.05,54.93 61.75,62.23 73.18,59.05 73.18,47.62 72.55,24.77 26.19,17.94 20.48,32.7 20.48,35.72 2.54,32.7 40.48,17.46 58.26,22.07 20.48,16.35 64.93,37.15 58.74,37.47 68.1,47.31 73.18,22.38 58.1,40.01 45.09,37.78 39.53,39.85 27.62,32.54 31.43,40.01 56.04,20.8 47.47,41.27 33.81,35.72 4.29,53.18 66.2,56.99 12.7,42.55 12.38,45.72 45.56,44.77 43.18,20.16 33.34,15.24 43.34,17.46 29.05,52.55 30.8,52.55 25.08,58.9 19.21,59.21 30.64,61.91 33.34,59.05 6.83,71.6 15.72,62.07 68.9,31.91 54.77,10 23.02,13.81 72.55,42.86 32.7,31.27 52.07,26.51 65.72,21.91 68.9,21.75 46.51,10.16 40.48,20.16 44.13,74.93 44.45,71.44 69.22,71.6 20,39.85 27.62,43.81 12.7,55.09 20.16,24.29 52.39,32.54 60.96,44.77 43.5,65.88 43.34,62.87 54.77,57.47 68.74,58.1 69.69,66.36 60.96,41.12 52.55,44.93 32.7,63.66 26.51,68.74 36.51,65.25 43.34,60.8 44.29,52.86 47.47,54.77 48.58,57.63 34.13,42.39 37.94,41.27 48.58,10.16 48.26,38.42 67.15,37.15 9.05,10.64 19.05,12.06 49.21,47.94
  pour Bottom: -2.54,6.35 80.01,6.35 80.01,78.74 -2.54,78.74
  pour Top: -5.08,6.35 81.28,6.35 81.28,80.01 -5.08,80.01
HALT  (via drill 0.3)
  Top 0.152: IC8.18 67.63,13.49 65.41,11.27 64.14,11.27 63.66,10.79 57.94,10.79 v56.67,9.53
  Bottom 0.152: U$1.P$34 48.26,6.99 48.9,7.62 50.48,7.62 50.8,7.94 52.7,7.94 53.66,8.89 56.04,8.89 v56.67,9.53
INT  (via drill 0.35)
  Top 0.152: v61.44,22.23 v61.44,19.84 | v54.45,56.2 52.23,53.98 48.9,53.98 v48.42,54.45 | U$1.P$37 53.34,7.3 52.86,7.78 52.39,7.78 51.59,8.57 51.59,9.84 53.68,11.93 56.02,11.93 56.31,12.22 60.8,12.22 IC8.16 62.55,14.92 v60.8,16.67 | v53.18,40.01 56.04,37.15 56.04,35.72 v56.83,34.92
  Bottom 0.152: R5.1 55.4,32.06 53.66,30.32 53.66,28.26 54.37,27.54 54.37,24.29 55.95,22.71 60.95,22.71 v61.44,22.23 61.28,22.07 | R5.1 55.41,34.08 | 55.41,34.08 55.56,33.66 | 55.56,33.66 55.72,33.66 | U$2.40 55.4,53.82 54.45,54.77 v54.45,56.2 | 48.42,53.98 v48.42,54.45 48.42,44.77 v53.18,40.01 | 55.4,33.81 55.56,33.66 | R5.1 55.4,34.76 | v60.8,16.67 61.44,17.3 v61.44,19.84 | v56.83,34.92 55.99,34.08 55.41,34.08
KEYBOARD_RX  (via drill 0.3, 0.35)
  Top 0.152: v73.82,25.4 74.28,25.86 74.28,43.31 70.33,47.26 70.33,49.85 | U$1.P$43 60.96,7.3 61.75,8.1 64.61,8.1 65.09,8.57 65.09,9.84 65.56,10.32 67.41,10.32 v68.58,11.48 | v70.33,50.64 70.33,49.85 | 70.33,49.85 68.9,48.42 68.9,47.15 v70.33,45.72
  Bottom 0.152: v68.58,11.48 68.63,11.48 68.74,11.59 71.12,11.59 71.75,12.22 73.18,12.22 73.82,12.86 73.82,15.08 73.03,15.88 73.03,19.68 74.06,20.72 74.06,25.16 v73.82,25.4 | v70.33,45.72 68.9,44.29 67.31,44.29 66.36,43.34 66.36,36.83 JP1.1 | U$2.20 68.84,50.64 v70.33,50.64
LED1  (via drill 0.35)
  Top 0.152: v63.82,62.07 63.82,63.34 63.02,64.14 54.13,64.14 48.9,69.37 LED1.K
  Bottom 0.152: U$2.8 64.62,61.27 v63.82,62.07
LED2  (via drill 0.35)
  Top 0.152: LED2.K 29.84,69.53 31.51,67.87 31.51,60.56 29.84,58.9 29.84,55.88 31.75,53.98 44.61,53.98 45.88,52.7 62.55,52.7 v63.82,53.98
  Bottom 0.152: U$2.22 67.5,49.02 66.04,50.48 64.77,50.48 63.82,51.44 v63.82,53.98
LEFT  (via drill 0.35)
  Top 0.152: RN1.4 15.05,64.93 21.27,64.93 21.75,64.45 U$16.16 v21.75,60.64
  Bottom 0.152: U$14.LEFT 1.68,61.84 3.49,63.66 4.6,63.66 6.67,65.72 7.94,65.72 8.41,66.2 10.03,66.2 RN1.4 | IC6.6 23.02,59.37 v21.75,60.64
MCU_RST  (via drill 0.35)
  Top 0.152: v30.32,38.89 31.75,38.89 36.67,43.81 48.1,43.81 49.21,42.7 56.99,42.7 | 56.99,42.7 | 56.99,42.7 R12.1 | 56.99,42.7 60.64,42.7 v61.12,43.18 62.39,44.45 62.39,45.88 63.02,46.51 65.72,46.51 67.15,47.94 67.15,53.18 v70.17,56.2 | U$1.P$33 48.26,7.78 51.12,10.64 51.12,15.08 52.15,16.11 54.85,16.11 55.24,16.51 55.24,17.94 55.72,18.41 56.2,18.41 57.31,17.3 65.56,17.3 66.67,18.41 66.67,25.08 64.77,26.99 62.55,26.99 61.28,28.26 61.28,31.11 60.48,31.91 60.48,35.88 v62.07,37.47
  Bottom 0.152: U$19.P$2 30.71,35.33 30.32,35.72 v30.32,38.89 | U$2.13 70.14,56.22 v70.17,56.2 | v61.12,43.18 60.17,42.23 60.17,39.37 v62.07,37.47
MENU  (via drill 0.35)
  Top 0.152: v28.1,60.48 U$16.11 28.1,64.58 RN1.9 | v21.75,40.48 23.02,41.75 23.02,47.31 v22.38,47.94 | U$5.P$1 24.68,35.63 26.35,37.31 v26.35,40.48
  Bottom 0.152: v21.75,40.48 v26.35,40.48 | v28.1,60.48 28.1,60.33 27.77,59.99 27.77,45.12 26.32,43.67 22.37,43.67 21.75,44.29 IC6.12 21.75,47.31 v22.38,47.94
MISO
  Bottom 0.152: U$15.P$3 50.96,51.44 49.37,53.02 49.37,60.96 51.91,63.5 64.29,63.5 67.02,60.77 U$2.11
MOSI
  Bottom 0.152: U$15.P$4 50.8,53.98 49.85,54.93 49.85,61.01 52.01,63.17 64.14,63.17 66.22,61.08 U$2.10
N$4
  Bottom 0.152: U$2.16 70.01,53.82 71.44,52.39 71.44,44.93 71.11,44.6 R6.2 71.11,41.47 Q1.2 72.26,36.39 C1.1
N$5
  Bottom 0.152: Q1.1 68.27,41.16 | 68.27,41.16 R6.1 68.74,42.86 71.12,45.24 71.12,52.23 70.33,53.02 U$2.17 | C2.1 70.96,38.42 70.96,39.69 70.33,40.32 69.1,40.32 68.27,41.16
N$6
  Bottom 0.152: IC1.2 33.02,26.19 34.29,27.46 45.56,27.46 46.04,27.94 46.04,30.64 46.51,31.11 46.51,34.29 46.99,34.77 50.16,34.77 52.39,36.99 58.26,36.99 59.21,36.04 JP2.2
N$16
  Bottom 0.152: IC1.3 IC1.4 IC1.5
N$28  (via drill 0.35)
  Top 0.152: v45.24,65.72 46.35,66.83 LED1.A
  Bottom 0.152: v45.24,65.72 46.36,65.72 R1.1
N$39
  Bottom 0.152: IC1.6 38.1,23.34 38.42,23.02 45.4,23.02 45.72,23.34 IC7.2
N$41  (via drill 0.35)
  Top 0.152: v50.8,23.02 49.53,21.75 v49.53,20.16
  Bottom 0.152: IC7.6 v50.8,23.02 | IC7.12 46.99,19.68 47.47,20.16 v49.53,20.16 IC7.10
N$45
  Bottom 0.152: LED2.A 27.3,69.69 27.63,69.37 R2.1
N$52
  Bottom 0.152: IC7.9 50.8,20.16 50.16,20.8 40.01,20.8 39.37,20.16 IC1.8
N$55
  Top 0.152: CN1.D+ 38.1,66.04 38.42,65.72 41.75,65.72 44.61,62.87 44.61,60.33 45.49,59.45 45.93,59.45 R7.1
N$56
  Top 0.152: CN1.D- 40.48,69.06 41.27,68.26 41.27,66.67 45.24,62.71 R8.1
NMI
  Top 0.152: IC8.17 65.09,13.49 63.18,11.59 56.83,11.59 56.52,11.27 54.77,11.27 53.34,9.84 53.34,8.26 53.82,7.78 55.4,7.78 55.88,7.3 U$1.P$39
RD  (via drill 0.3, 0.35)
  Top 0.152: v10.16,26.67 U$3.22 10.16,22.54 9.53,21.91 9.53,16.19 v9.21,15.88 | U$4.22 v10.16,38.73 14.45,34.45 31.27,34.45 31.91,35.08 31.91,38.42 36.82,43.33 39.67,43.33 39.69,43.34 47.78,43.34 48.91,42.22 61.27,42.22 62.87,43.81 62.87,45.4 v63.18,45.72 67.15,45.72 70.8,42.07 70.8,39.53 73.67,36.66 73.67,30.18 IC8.21
  Bottom 0.152: v10.16,26.67 v10.16,38.73 | v63.18,45.72 62.39,45.73 61.25,45.73 60.62,46.35 U$2.31 | U$1.P$4 10.16,7.3 9.53,7.94 7.62,7.94 3.49,12.06 3.49,14.61 4.13,15.24 7.14,15.24 7.94,16.03 9.05,16.03 v9.21,15.88
RIGHT  (via drill 0.35)
  Top 0.152: RN1.5 17.27,65.25 22.54,65.25 23.02,64.77 U$16.15 v23.02,60.64
  Bottom 0.152: U$14.RIGHT 10.48,62.33 10.48,65.56 11.11,66.2 12.57,66.2 RN1.5 | IC6.7 24.29,59.37 v23.02,60.64
SCK
  Bottom 0.152: U$2.9 65.42,61.42 63.98,62.87 52.23,62.87 50.4,61.04 50.4,56.91 50.8,56.52 U$15.P$5
SCL  (via drill 0.3, 0.35)
  Top 0.152: v5.71,47.78 5.71,53.82 6.03,54.13 7.94,54.13 8.57,53.5 10.16,53.5 10.48,53.18 10.48,52.7 11.43,51.75 v12.06,51.75 | U$13.P$3 37.94,62.07 33.97,62.07 v30.48,58.58 30.48,55.72 31.75,54.45 46.04,54.45 47.15,53.34 53.02,53.34 54.93,55.24 56.2,55.24 57.47,53.98 62.87,53.98 63.34,54.45 63.34,56.04 63.9,56.59 64.45,56.59 65.09,55.96 65.09,53.34 v64.45,52.7 | v6.67,11.27 v2.86,11.27
  Bottom 0.152: IC4.14 39.21,36.2 32.54,42.86 21.11,42.86 19.21,44.77 IC6.14 19.21,47.62 17.62,49.21 13.34,49.21 12.06,50.48 v12.06,51.75 12.06,52.39 15.88,56.2 15.88,59.53 18.1,61.75 25.88,61.75 26.35,62.23 28.26,62.23 30.48,60.01 v30.48,58.58 | v5.71,47.78 4.92,46.99 IC5.14 4.92,44.93 4.13,44.13 3.02,44.13 1.75,42.86 1.75,12.38 v2.86,11.27 | U$2.18 67.31,52.22 66.83,52.7 v64.45,52.7 | U$1.P$26 38.1,7.46 37.78,7.78 35.67,7.78 33.77,9.68 9.05,9.68 7.46,11.27 v6.67,11.27
SDA  (via drill 0.3, 0.35)
  Top 0.152: v3.81,47.78 3.81,50.16 5.41,51.77 5.41,53.98 5.89,54.45 8.1,54.45 8.73,53.82 10.55,53.82 10.75,53.62 v11.43,52.86 | U$13.P$4 40.18,61.77 34.14,61.77 31.11,58.74 v31.11,57.94 31.11,55.72 32.07,54.77 46.35,54.77 47.47,53.66 52.7,53.66 54.61,55.56 56.52,55.56 57.78,54.29 62.71,54.29 63.02,54.61 63.02,56.36 63.66,56.99 64.69,56.99 65.48,56.2 65.48,52.78 v64.45,51.75 | v3.65,10.48 v7.3,10.48
  Bottom 0.152: IC4.15 37.94,37.03 32.42,42.56 20.78,42.56 18.89,44.45 18.26,44.45 17.94,44.77 IC6.15 17.94,47.62 16.67,48.9 13.18,48.9 10.79,51.28 10.79,52.23 v11.43,52.86 11.91,52.86 15.56,56.52 15.56,59.69 17.93,62.06 25.7,62.06 26.19,62.55 28.57,62.55 31.11,60.01 v31.11,57.94 | v3.81,47.78 3.65,47.62 IC5.15 3.65,44.77 3.33,44.45 2.86,44.45 1.43,43.02 1.43,11.59 2.54,10.48 v3.65,10.48 | U$2.19 67.15,51.42 66.82,51.75 v64.45,51.75 | U$1.P$24 35.56,7.46 33.66,9.37 8.41,9.37 v7.3,10.48
SLOWCLK  (via drill 0.3, 0.35)
  Top 0.152: v57.78,36.35 57.78,38.42 v57.63,38.58
  Bottom 0.152: IC7.1 44.45,26.67 44.93,27.15 47.47,27.15 48.58,28.26 48.58,30.64 46.82,32.4 46.82,34.12 47.15,34.45 50.32,34.45 52.23,36.35 v57.78,36.35 | U$2.33 59.02,39.02 58.58,38.58 v57.63,38.58 57.31,38.26 R10.2
START  (via drill 0.35)
  Top 0.152: RN1.8 22.07,67.79 23.5,66.36 25.24,66.36 26.83,64.77 U$16.12 v26.83,60.64 26.19,60.01 18.73,60.01 17,58.27 15.43,58.27 13.81,56.65 13.81,51.91 17.39,48.33 U$6.P$2
  Bottom 0.152: IC6.11 23.02,44.61 23.65,43.97 26.19,43.97 27.46,45.24 27.46,60.01 v26.83,60.64
UP  (via drill 0.35)
  Top 0.152: RN1.2 6.83,67.15 10.95,63.02 12.7,63.02 13.97,64.29 18.89,64.29 19.21,63.98 U$16.18 v19.21,60.64
  Bottom 0.152: U$14.UP 4.2,64.53 6.83,67.15 RN1.2 | IC6.4 20.48,59.37 v19.21,60.64
VBUS
  Bottom 1.016: 39.7,66.69 39.69,66.67
  Bottom 1.27: 39.7,66.69 CN1.VBUS 72.27,67.75 75.18,64.83 75.18,55.88 74.64,55.34 U$18.P$4
VCC  (via drill 0.3, 0.35)
  Top 0.254: v53.82,33.02 54.61,32.23 56.2,32.23 v56.67,31.75
  Top 0.508: U$3.28 2.54,26.67 1.43,27.78 1.43,33.81 2.54,34.92 v2.54,38.73 U$4.28 2.54,41.59 1.98,42.15 1.98,49.29 2.38,49.69 v2.38,51.12 v2.38,53.5 2.38,54.29 5.71,57.63 5.71,61.91 | RN1.1 4.29,66.04 5.71,64.61 5.71,61.91 | 16.67,59.85 v14.45,62.07 v13.49,62.07 5.87,62.07 5.71,61.91 | 16.67,59.85 U$16.20 | v16.99,59.53 16.67,59.85 | R12.2 v54.14,46.03 v54.13,46.04
  Top 0.61: 49.85,18.1 IC8.11 | v60.17,23.81 v60.17,24.61 v60.17,25.4 | v31.75,20.16 32.7,21.11 44.61,21.11 45.56,20.16 | 45.56,20.16 47.31,18.41 47.62,18.1 49.85,18.1 | v44.45,20.16 45.56,20.16 | v60.17,23.81 60.17,21.11 59.53,20.48 58.1,20.48 56.83,21.75 55.24,21.75 51.59,18.1 49.85,18.1 | v60.17,23.81 62.07,23.81 62.55,23.34 v62.55,20.16
  Bottom 0.254: R3.2 58.89,25.09 56.2,27.78 56.2,31.27 v56.67,31.75 | R5.2 52.71,33.81 53.5,33.81 53.82,33.5 v53.82,33.02
  Bottom 0.508: IC2.16 v62.55,20.16 | IC7.14 v44.45,20.16 | v31.75,20.16 IC1.14 | IC5.16 v2.38,51.12 6.19,51.12 7.3,50.01 9.37,50.01 11.11,48.26 15.56,48.26 16.67,47.15 IC6.16 16.67,44.61 18.25,43.03 19.41,41.76 20.53,41.75 32.07,41.75 36.67,37.15 IC4.16 | 52.07,48.74 U$15.P$2 53.34,48.9 54.13,48.1 v54.13,46.04 54.13,44.93 53.51,44.3 R11.2 | U$2.24 66.22,49.05 65.43,49.85 64.45,49.85 62.87,51.44 62.87,54.77 | 61.39,55.42 62.23,55.42 62.87,54.77 | 61.39,55.42 60.48,54.51 60.48,49.69 59.82,49.02 58.26,49.02 | 61.39,55.42 59.82,56.99 U$2.2 59.82,60.35 59.37,60.8 56.83,60.8 55.88,59.85 55.88,57.31 56.17,57.02 U$2.44 | IC5.1 v2.38,53.5 | 29.69,64.93 32.78,61.83 36.83,61.83 | IC6.2 17.94,58.58 v16.99,59.53 | R11.2 54.13,43.49 | 71.28,55.4 71.26,55.42 U$2.14 67.33,55.42 66.67,54.77 62.87,54.77 | v13.49,62.07 v14.45,62.07 17.3,64.93 29.69,64.93 | R2.2 30.47,65.72 29.69,64.93 | 58.26,49.02 U$2.34 | 58.26,49.02 57.94,48.7 57.94,41.59 57.63,41.27 53.82,41.27 53.5,41.59 53.51,41.6 R11.2 | R3.2 60.17,24.92 | 36.83,61.83 46.28,61.83 49.36,64.92 | U$13.P$2 36.83,61.83
  Bottom 0.61: v60.17,23.81 v60.17,24.61 60.17,24.92 v60.17,25.4 60.17,26.67 60.8,27.3 75.18,27.3
  Bottom 1.016: U$18.P$3 72.55,53.34 71.28,54.61 71.28,55.4 71.28,62.87 68.42,65.72 50.16,65.72 49.36,64.92 R1.2
  Bottom 1.27: U$1.P$50 68.58,7.62 70.8,9.84 73.66,9.84 75.18,11.37 75.18,27.3 75.18,52.7 74.55,53.34 U$18.P$3
WAIT  (via drill 0.3)
  Top 0.152: IC8.24 65.09,27.94 67.31,25.72 67.31,17.94 66.36,16.99 66.36,13.02 64.93,11.59 63.98,11.59 63.5,11.11 57.31,11.11 v55.72,9.53
  Bottom 0.152: v55.72,9.53 55.39,9.2 53.53,9.2 52.59,8.26 50.48,8.26 50.15,7.92 46.5,7.92 45.72,7.14 U$1.P$32
WR  (via drill 0.3, 0.35)
  Top 0.152: v3.81,26.67 U$3.27 3.81,22.38 3.17,21.75 v3.17,15.88 | U$4.27 v3.81,38.73 4.76,37.78 10.64,37.78 14.45,33.97 31.43,33.97 32.23,34.77 32.23,38.3 36.94,43.02 47.62,43.02 48.74,41.91 61.59,41.91 63.18,43.5 63.18,44.45 63.66,44.93 v64.61,44.93 67.31,44.93 70.48,41.75 70.48,39.37 73.37,36.49 73.37,32.41 IC8.22
  Bottom 0.152: v3.81,26.67 v3.81,38.73 | v64.61,44.93 U$2.26 | U$1.P$2 7.62,7.46 3.17,11.91 v3.17,15.88
Z80CLK  (via drill 0.3, 0.35)
  Top 0.152: v51.59,21.11 51.59,23.34 51.12,23.81 50.48,23.81 49.21,22.54 v46.99,22.54 | IC8.6 37.15,12.7 37.47,12.38 38.1,12.38 39.69,10.79 39.69,9.21 39.21,8.73 38.58,8.73 37.94,8.1 36.51,8.1 36.35,7.94 v33.02,7.94
  Bottom 0.152: U$1.P$22 v33.02,7.94 | IC8.6 39.45,16.27 43.42,16.27 43.97,15.72 48.72,15.72 49.53,16.52 52.08,16.52 53.02,17.46 53.02,19.68 v51.59,21.11 | v46.99,22.54 IC7.3
Z80RESET  (via drill 0.3, 0.35)
  Top 0.152: v60.17,45.72 60.17,49.21 59.85,49.53 59.69,49.53 | IC8.26 60.01,30.64 59.05,31.59 57.94,31.59 56.67,32.86 55.09,32.86 53.98,33.97 53.98,36.67 50.32,40.32 46.67,40.32 46.28,39.93 | v56.36,47.78 58.1,49.53 59.69,49.53 | U$17.P$2 46.43,35.8 45.88,36.35 45.88,39.53 46.28,39.93 | v20.64,22.23 20.8,22.07 25.26,22.07 29.87,17.46 36.17,17.46 36.83,18.12 44.9,18.12 46.04,16.99 46.04,12.86 45.24,12.06 43.66,12.06 43.02,11.43 43.02,8.57 v42.39,7.94 | v34.92,36.51 39.53,41.12 45.09,41.12 46.28,39.93 | v59.69,50.01 59.69,49.53
  Bottom 0.152: U$2.1 59.02,56.23 59.85,55.4 59.85,50.16 v59.69,50.01 | v60.17,45.72 59.69,45.24 59.69,38.58 63.02,35.24 63.02,32.23 62.39,31.59 61.44,31.59 60.01,30.16 IC8.26 | v56.36,47.78 56.35,47.78 56.98,47.78 56.99,47.78 57.31,47.47 57.31,43.98 R11.1 | U$1.P$28 40.64,7.3 41.12,7.78 42.23,7.78 v42.39,7.94 | v34.92,36.51 34.92,35.56 30.48,31.11 23.89,31.11 23.26,30.48 23.26,29.13 21.11,26.99 21.11,26.19 21.59,25.72 21.59,23.18 v20.64,22.23

## Text on the board
tPlace: A | B | ON | JOYSTICK | MENU | KEYRX | Z80 | START | RESET | 64K SRAM | Z80 CPU